# Altium schematic sheet 06_01_MCU.SchDoc: MCU
size A4; Author: Gabriel; Organization: Altium Limited; Address1: L3, 12a Rodborough Rd; Address2: Frenchs Forest; Address3: NSW; Address4: Australia 2086; SheetNumber: 1; SheetTotal: 1; Subtitle: XDRONE
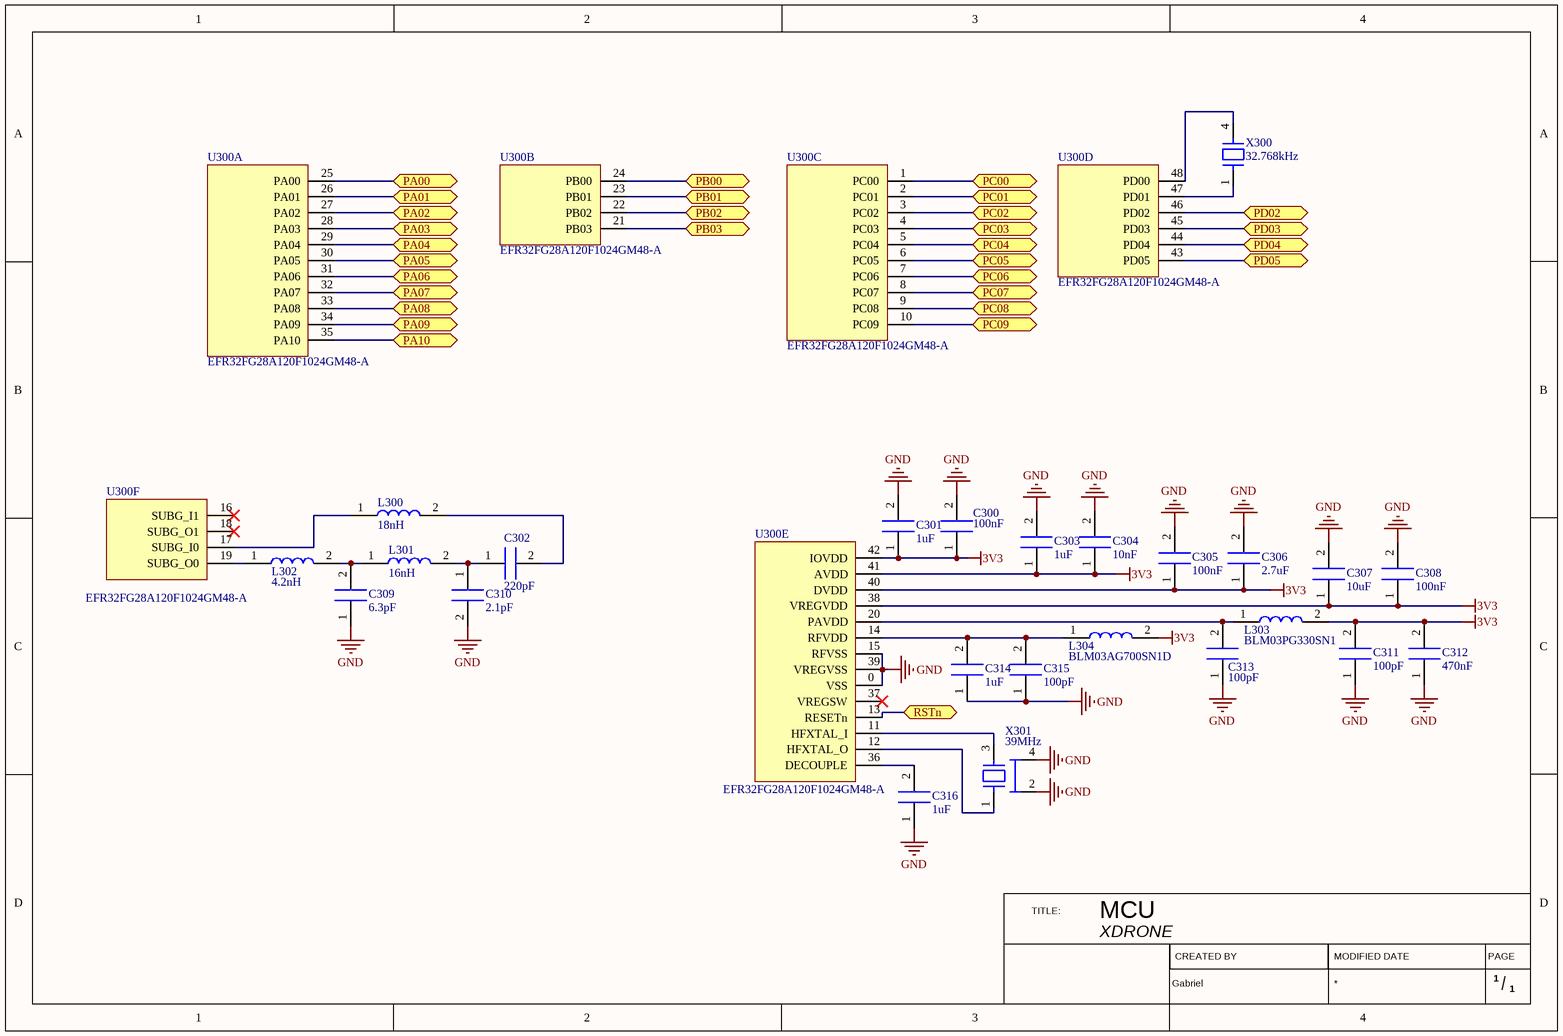
[diagram p0: 06_01_MCU.SchDoc]

## Parts
C300  value 100nF  [CAP_0402]  (hidden comment: 100nF_10%_16V_0402_GRM155R71C104KA88J)
C301  value 1uF  [CAP_0402]  (hidden comment: 1uF_10%_35V_0402_GRM155R6YA105KE11J)
C302  value 220pF  [CAP_0805]  (hidden comment: 220pF_5%_50V_0805_C0G,NP0_QSCT251Q221J1GV001E)
C303  value 1uF  [CAP_0402]  (hidden comment: 1uF_10%_35V_0402_GRM155R6YA105KE11J)
C304  value 10nF  [CAP_0402]  (hidden comment: 10nF_10%_6.3V_0402_CC0402KRX7R5BB103)
C305  value 100nF  [CAP_0402]  (hidden comment: 100nF_10%_16V_0402_GRM155R71C104KA88J)
C306  value 2.7uF  [CAP_0805]  (hidden comment: 2.7uF_10%_10V_0805_X5R_C0805C275K8PAC7800)
C307  value 10uF  [CAP_0402]  (hidden comment: 10uF_20%_6.3V_0402_GRM155R60J106ME05D)
C308  value 100nF  [CAP_0402]  (hidden comment: 100nF_10%_16V_0402_GRM155R71C104KA88J)
C309  value 6.3pF  [CAP_0402]  (hidden comment: 6.3pF_1.5%_50V_0402_CBR04C639B5GAC)
C310  value 2.1pF  [CAP_0402]  (hidden comment: 2.1pF_5%_50V_0402_GJM1555C1H2R1BB01D)
C311  value 100pF  [CAP_0402]  (hidden comment: 100pF_5%_50V_0402_CC0402JRNPO9BN101)
C312  value 470nF  [CAP_0402]  (hidden comment: 470nF_10%_6.3V_0402_GCM1555C1H101JA16D)
C313  value 100pF  [CAP_0402]  (hidden comment: 100pF_5%_50V_0402_CC0402JRNPO9BN101)
C314  value 1uF  [CAP_0402]  (hidden comment: 1uF_10%_35V_0402_GRM155R6YA105KE11J)
C315  value 100pF  [CAP_0402]  (hidden comment: 100pF_5%_50V_0402_CC0402JRNPO9BN101)
C316  value 1uF  [CAP_0402]  (hidden comment: 1uF_10%_35V_0402_GRM155R6YA105KE11J)
L300  value 18nH  [RF_IND_0402]  (hidden comment: 18nH_2%_400mA_LQG15HS18NG02D)
L301  value 16nH  [RF_IND_0402]  (hidden comment: 16nH_3%_400mA_MLG1005S16NHT000)
L302  value 4.2nH  [RF_IND_0402]  (hidden comment: 4.2nH_5%_1.8A_LQW15AN4N2C8ZD)
L303  MANUFACTURER REFERENCE: BLM03PG330SN1  [IND_0201]  (hidden comment: 52nH_25%_750mA_BLM03PG330SN1)
L304  MANUFACTURER REFERENCE: BLM03AG700SN1D  [IND_0201]  (hidden comment: 110nH_50%_200mA_BLM03AG700SN1D)
U300  MANUFACTURER REFERENCE: EFR32FG28A120F1024GM48-A  [QFN48 0606]  (hidden comment: MCU_1MB_256kB_EFR32FG28A120F1024GM48-A)  (parts A,B,C,D,E,F of 6)
X300  FREQUENCY: 32.768kHz  [QUARTZ_4-SOJ_5.5mm]  (hidden comment: QUARTZ_32.768kHz_20ppm_830016178)
X301  FREQUENCY: 39MHz  [QUARTZ_4-SMD]  (hidden comment: QUARTZ_39MHz_10ppm_ECS-390-10-37B-CKM-TR)

## Ports
PA00, PA01, PA02, PA03, PA04, PA05, PA06, PA07, PA08, PA09, PA10, PB00, PB01, PB02, PB03, PC00, PC01, PC02, PC03, PC04, PC05, PC06, PC07, PC08, PC09, PD02, PD03, PD04, PD05, RSTn

## Nets
3V3: C300.1 C301.1 C303.1 C304.1 C305.1 C306.1 C307.1 C308.1 C311.2 C312.2 L303.2 L304.2 U300.38(VREGVDD) U300.40(DVDD) U300.41(AVDD) U300.42(IOVDD)
GND: C300.2 C301.2 C303.2 C304.2 C305.2 C306.2 C307.2 C308.2 C309.1 C310.2 C311.1 C312.1 C313.1 C314.1 C315.1 C316.1 U300.0(VSS) U300.15(RFVSS) U300.39(VREGVSS) X301.2 X301.4
PA00: U300.25(PA00) ; port PA00
PA01: U300.26(PA01) ; port PA01
PA02: U300.27(PA02) ; port PA02
PA03: U300.28(PA03) ; port PA03
PA04: U300.29(PA04) ; port PA04
PA05: U300.30(PA05) ; port PA05
PA06: U300.31(PA06) ; port PA06
PA07: U300.32(PA07) ; port PA07
PA08: U300.33(PA08) ; port PA08
PA09: U300.34(PA09) ; port PA09
PA10: U300.35(PA10) ; port PA10
PB00: U300.24(PB00) ; port PB00
PB01: U300.23(PB01) ; port PB01
PB02: U300.22(PB02) ; port PB02
PB03: U300.21(PB03) ; port PB03
PC00: U300.1(PC00) ; port PC00
PC01: U300.2(PC01) ; port PC01
PC02: U300.3(PC02) ; port PC02
PC03: U300.4(PC03) ; port PC03
PC04: U300.5(PC04) ; port PC04
PC05: U300.6(PC05) ; port PC05
PC06: U300.7(PC06) ; port PC06
PC07: U300.8(PC07) ; port PC07
PC08: U300.9(PC08) ; port PC08
PC09: U300.10(PC09) ; port PC09
PD02: U300.46(PD02) ; port PD02
PD03: U300.45(PD03) ; port PD03
PD04: U300.44(PD04) ; port PD04
PD05: U300.43(PD05) ; port PD05
RSTn: U300.13(RESETn) ; port RSTn
NetC302_1: C302.1 C310.1 L301.2
NetC302_2: C302.2 L300.2
NetC309_2: C309.2 L301.1 L302.2
NetC313_2: C313.2 L303.1 U300.20(PAVDD)
NetC314_2: C314.2 C315.2 L304.1 U300.14(RFVDD)
NetC316_2: C316.2 U300.36(DECOUPLE)
NetL300_1: L300.1 U300.17(SUBG_I0)
NetL302_1: L302.1 U300.19(SUBG_O0)
NetU300_11: U300.11(HFXTAL_I) X301.3
NetU300_12: U300.12(HFXTAL_O) X301.1
NetU300_47: U300.47(PD01) X300.1
NetU300_48: U300.48(PD00) X300.4

Not connected (* = marked no-connect by the designer): U300 16(SUBG_I1)* 18(SUBG_O1)* 37(VREGSW)*

## Notes on the sheet
- TITLE:
- CREATED BY
- MODIFIED DATE
- PAGE
- /

## Library data of the parts
C300 C305 C308 = 100nF_10%_16V_0402_GRM155R71C104KA88J: CAPACITOR 100nF 10% X7R 0402; MANUFACTURER: MURATA; DIELECTRIC: X5R; VOLTAGE RATING: 16V; TOLERANCE: 10%; PACKAGING: 0402; MOUNTING: SMD; MANUFACTURER REFERENCE: GRM155R71C104KA88J
C301 C303 C314 C316 = 1uF_10%_35V_0402_GRM155R6YA105KE11J: CAPACITOR 1uF 10% X5R 0402; MANUFACTURER: MURATA; VOLTAGE RATING: 35V; DIELECTRIC: X5R; TOLERANCE: 10%; PACKAGING: 0402; MOUNTING: SMD; MANUFACTURER REFERENCE: GRM155R6YA105KE11J
C302 = 220pF_5%_50V_0805_C0G,NP0_QSCT251Q221J1GV001E: CAP 220pF 5% 50V 0805 C0G,NP0; MANUFACTURER: JOHANSON TECHLONOGY; DIELECTRIC: C0G, NP0; TOLERANCE: 5%; VOLTAGE RATING: 50V; PACKAGING: 0805; MOUNTING: SMD; MANUFACTURER REFERENCE: QSCT251Q221J1GV001E
C304 = 10nF_10%_6.3V_0402_CC0402KRX7R5BB103: CAPACITOR 10nF 10% 6.3V 0402 CC0402KRX7R5BB103; MANUFACTURER: YAGEO; DIELECTRIC: X7R; TOLERANCE: 10%; VOLTAGE RATING: 6.3V; PACKAGING: 0402; MOUNTING: SMD; MANUFACTURER REFERENCE: CC0402KRX7R5BB103
C306 = 2.7uF_10%_10V_0805_X5R_C0805C275K8PAC7800: CAP 2.7uF 10% 10V 0805 X5R C0805C275K8PAC7800; MANUFACTURER: KEMET; DIELECTRIC: X5R; TOLERANCE: 10%; VOLTAGE RATING: 10V; PACKAGING: 0805; MOUNTING: SMD; MANUFACTURER REFERENCE: C0805C275K8PAC7800
C307 = 10uF 20% 6.3V 0402 GRM155R60J106ME05D: CAPACITOR 10uF 20% 6.3V 0402 GRM155R60J106ME05D; MANUFACTURER: MURATA; DIELECTRIC: X5R; TOLERANCE: 20%; VOLTAGE RATING: 6.3V; PACKAGING: 0402; MOUNTING: SMD; MANUFACTURER REFERENCE: GRM155R60J106ME05D
C309 = 6.3pF_1.5%_50V_0402_CBR04C639B5GAC: CAPACITOR 6.3pF 1.5% 50V 0402 CBR04C639B5GAC; MANUFACTURER: KEMET; DIELECTRIC: C0G, NP0; TOLERANCE: 1.5%; VOLTAGE RATING: 50V; PACKAGING: 0402; MOUNTING: SMD; MANUFACTURER REFERENCE: CBR04C639B5GAC
C310 = 2.1pF_5%_50V_0402_GJM1555C1H2R1BB01D: CAPACITOR 2.1pF 5% 50V 0402 GJM1555C1H2R1BB01D; MANUFACTURER: MURATA; DIELECTRIC: C0G, NP0; TOLERANCE: 5%; VOLTAGE RATING: 50V; PACKAGING: 0402; MOUNTING: SMD; MANUFACTURER REFERENCE: GJM1555C1H2R1BB01D
C311 C313 C315 = 100pF_5%_50V_0402_CC0402JRNPO9BN101: CAPACITOR 100pF 5% 50V 0402 CC0402JRNPO9BN101; MANUFACTURER: YAGEO; DIELECTRIC: C0G, NP0; TOLERANCE: 5%; VOLTAGE RATING: 50V; PACKAGING: 0402; MOUNTING: SMD; MANUFACTURER REFERENCE: CC0402JRNPO9BN101
C312 = 470nF_10%_6.3V_0402_GCM1555C1H101JA16D: CAPACITOR 470nF 10% 6.3V 0402 GCM1555C1H101JA16D; MANUFACTURER: MURATA; DIELECTRIC: X6S; TOLERANCE: 5%; VOLTAGE RATING: 6.3V; PACKAGING: 0402; MOUNTING: SMD; MANUFACTURER REFERENCE: GCM1555C1H101JA16D
L300 = 18nH_2%_400mA_LQG15HS18NG02D: INDUCTOR 18nH 2% 400mA LQG15HS18NG02D; MANUFACTURER: MURATA; TOLERANCE: 2%; PACKAGING: 0402; MOUNTING: SMD; CURRENT RATING: 400mA; MANUFACTURER REFERENCE: LQG15HS18NG02D
L301 = 16nH_3%_400mA_MLG1005S16NHT000: INDUCTOR 16nH 3% 400mA MLG1005S16NHT000; MANUFACTURER: TDK; TOLERANCE: 3%; PACKAGING: 0402; MOUNTING: SMD; CURRENT RATING: 400mA; MANUFACTURER REFERENCE: MLG1005S16NHT000
L302 = 4.2nH_5%_1.8A_LQW15AN4N2C8ZD: INDUCTOR 4.2nH 5% 1.8A LQW15AN4N2C8ZD; MANUFACTURER: MURATA; TOLERANCE: 5%; PACKAGING: 0402; MOUNTING: SMD; CURRENT RATING: 1.8A; MANUFACTURER REFERENCE: LQW15AN4N2C8ZD
L303 = 52nH_25%_750mA_BLM03PG330SN1: INDUCTOR 52uH 25% 750mA BLM03PG330SN1; MANUFACTURER: MURATA; VALUE: 52nF; TOLERANCE: 25%; PACKAGING: 0201; MOUNTING: SMD; CURRENT RATING: 750mA
L304 = 110nH 50% 200mA BLM03AG700SN1D: INDUCTOR 110nH 50% 200mA BLM03AG700SN1D; MANUFACTURER: MURATA; TOLERANCE: 50%; PACKAGING: 0201; MOUNTING: SMD; CURRENT RATING: 200mA; VALUE: 110nH
U300 = MCU_1MB_256kB_EFR32FG28A120F1024GM48-A: MCU 1MB 256kB EFR32FG28A120F1024GM48-A; MANUFACTURER: SILICON LABS; PACKAGING: QFN48 0606; FLASH SIZE: 1 MB; RAM SIZE: 256 KB; PIN COUNT: 48
X300 = QUARTZ_32.768kHz_20ppm_830016178: QUARTZ 32.768kHz 20ppm 830016178; MANUFACTURER: WURTH; MANUFACTURER REFERENCE: 830016178; MOUNTING: SMD; PACKAGING: 4-SOJ; TOLERANCE: 20 ppm
X301 = QUARTZ_39MHz_10ppm_ECS-390-10-37B-CKM-TR: QUARTZ 39MHz 10ppm ECS-390-10-37B-CKM-TR; MANUFACTURER: ECS; MANUFACTURER REFERENCE: ECS-390-10-37B-CKM-TR; MOUNTING: SMD; PACKAGING: 4-SMD; TOLERANCE: 10 ppm; STABILITY: 10 ppm